# Altium schematic sheet UV LED.SchDoc: UV LED
size 292 x 193 mm; SheetNumber: 5; SheetTotal: 5
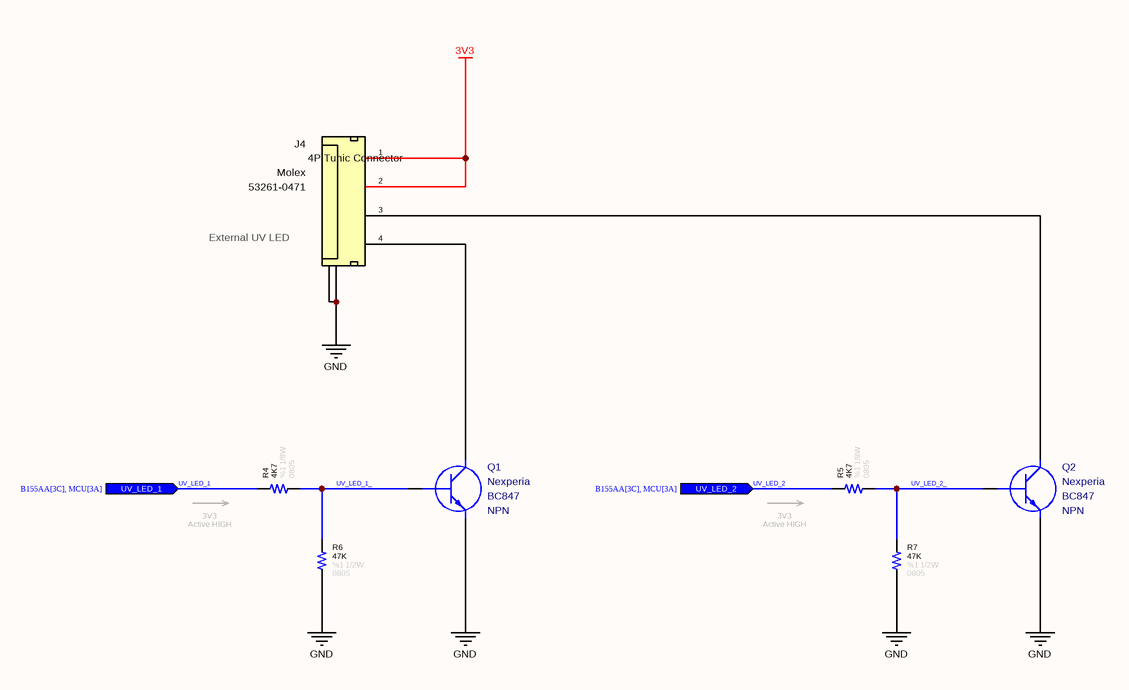
[diagram p0: UV LED.SchDoc]

## Parts
J4  Manufacturer Name: Molex  Manufacturer Part Number: 53261-0471  [Connector_Tunic 4P]  (hidden comment: 4P SMD Tunic Connector)
Q1  Manufacturer Name: Nexperia  Manufacturer Part Number: BC847  Polarity: NPN  [SOT-23-3]  (hidden comment: BC847AQAZ)
Q2  Manufacturer Name: Nexperia  Manufacturer Part Number: BC847  Polarity: NPN  [SOT-23-3]  (hidden comment: BC847AQAZ)
R4  value 4K7  Tolerance: %1  Case: 0805  Power: 1/8W  [RESISTOR_0805]  (hidden comment: 4K7 - 0805 - %1 - 1/16W)
R5  value 4K7  Tolerance: %1  Case: 0805  Power: 1/8W  [RESISTOR_0805]  (hidden comment: 4K7 - 0805 - %1 - 1/16W)
R6  value 47K  Tolerance: %1  Case: 0805  Power: 1/2W  [RESISTOR_0805]  (hidden comment: 47K - 0805 - %1 - 1/2W)
R7  value 47K  Tolerance: %1  Case: 0805  Power: 1/2W  [RESISTOR_0805]  (hidden comment: 47K - 0805 - %1 - 1/2W)

## Ports
UV_LED_1 (in, see B155AA[3C], MCU[3A]), UV_LED_2 (in, see B155AA[3C], MCU[3A])

## Nets
3V3: J4.1(BAT+) J4.2(BAT+)
GND: J4.5(GND) J4.6(GND) Q1.2(E) Q2.2(E) R6.1 R7.1
UV_LED_1: R4.2 ; port UV_LED_1
UV_LED_1_: Q1.1(B) R4.1 R6.2
UV_LED_2: R5.2 ; port UV_LED_2
UV_LED_2_: Q2.1(B) R5.1 R7.2
NetJ4_3: J4.3(BAT-) Q2.3(C)
NetJ4_4: J4.4(BAT-) Q1.3(C)

## Notes on the sheet
- (near J4) External UV LED
- (near R4) 3V3
  Active HIGH
- (near R5) 3V3
  Active HIGH
- © 2022 All rights reserved.
  This document may not, in whole or in part, be copied, photocopied, reproduced, translated or converted to any electronic or machine readable from without prior written permission of Mehmet Günce Akkoyun.
  Engineer contact : akkoyun@me.com
- Property of
- Engineer :
- Date :
- Size :
- A4
- Time :
- Project :
- Page :
- /
- Customer :
- Product ID :
- Module ID :
- Version :
- File :
- Revision :
- (in symbol Connector - Mini Tunic 4P (1.25)) 4P Tunic Connector

## Library data of the parts
J4 = Connector - Mini Tunic 4P (1.25): Mini Tunic Connector with 4P; Pitch: 1.25mm; Position: 4; ROHS: Yes; ComponentLink1Description: DataSheet; ComponentLink1URL: https://www.mouser.com.tr/datasheet/2/276/0532610471_PCB_HEADERS-170942.pdf; ComponentLink2Description: Mouser; ComponentLink2URL: https://www.mouser.com.tr/ProductDetail/Molex/53261-0471?qs=%2Fha2pyFaduhLhIsk8tywtK7BwWtguBSP4XxyDBTOTfs%3D; Case: SMD
Q1 Q2 = Transistor - BC847 (SOT23-3): Bipolar NPN Transistors; Case: SOT23-3
R4 R5 = Resistor - 4K7 [0805]: Thick Film Resistors - SMD 1/16 W 4.7 KOhm 1%; Manufacturer Name: Vishay; Manufacturer Part Number: CRCW08054K70FKEC; ComponentLink1Description: DataSheet; ComponentLink1URL: https://www.mouser.com.tr/datasheet/2/427/dcrcwe3-1762152.pdf; ComponentLink2Description: Mouser; ComponentLink2URL: https://www.mouser.com.tr/ProductDetail/Vishay-Dale/CRCW04024K70FKED?qs=sGAEpiMZZMu61qfTUdNhG7nHf%2F6MTUn3HadIdDQu24Q%3D
R6 R7 = Resistor - 47K [0805]: Thick Film Resistors - SMD 1/2 W 47 KOhm 1%; Manufacturer Name: Vishay; Manufacturer Part Number: CRCW080547K0FKECHP